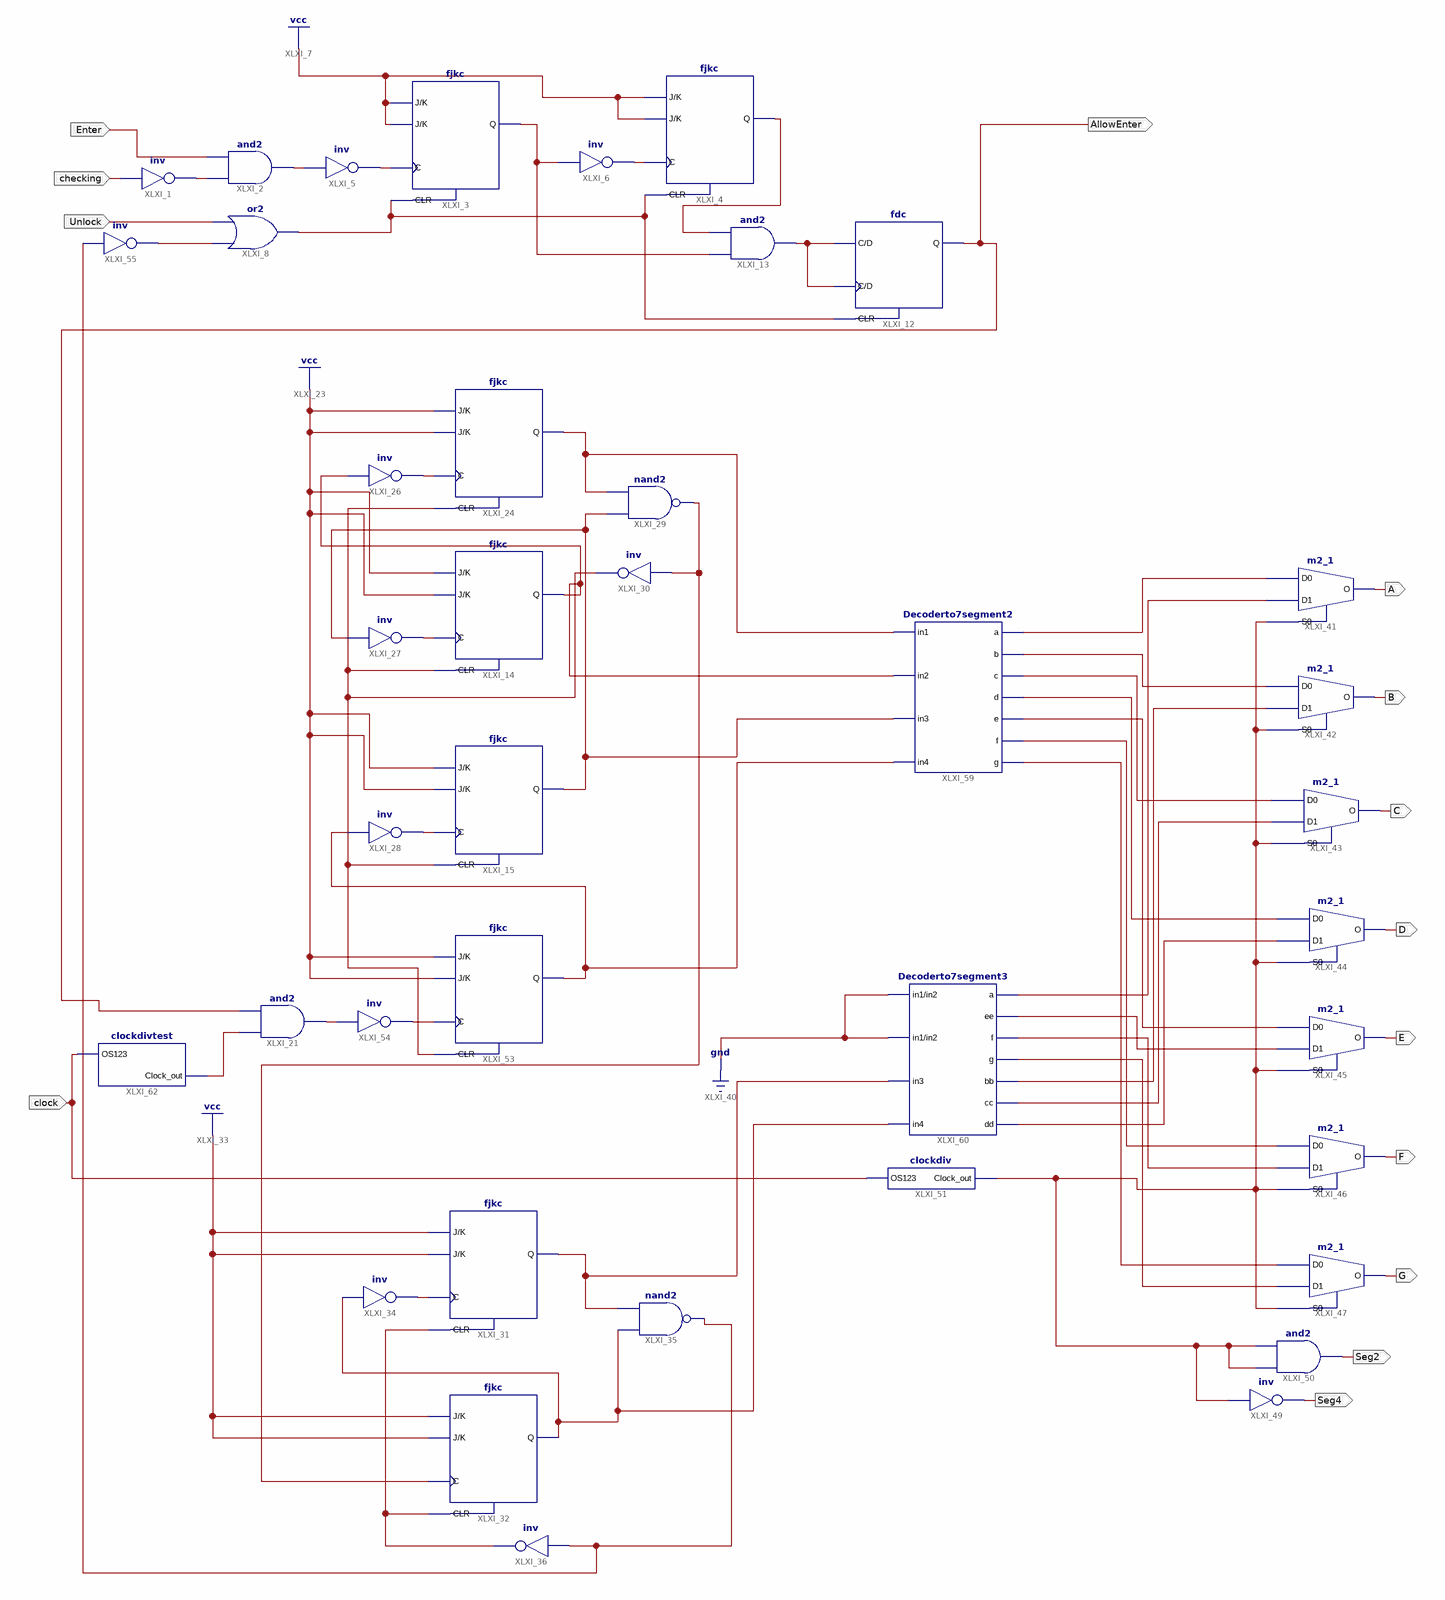
[diagram p0: schematic sheet 1]
// Xilinx ISE schematic counter30.sch (spartan6) as structural Verilog: 39 symbols, 14 ports
module counter30 (
  input  checking,
  input  Enter,
  input  Unlock,
  input  clock,
  output AllowEnter,
  output Seg4,
  output A,
  output B,
  output C,
  output D,
  output E,
  output F,
  output G,
  output Seg2
);

  wire XLXN_33, XLXN_35, XLXN_36, XLXN_38, XLXN_39, XLXN_45, XLXN_49, XLXN_50, XLXN_70, XLXN_71, XLXN_72,
       XLXN_73, XLXN_75, XLXN_76, XLXN_77, XLXN_78, XLXN_83, XLXN_84, XLXN_85, XLXN_86, XLXN_87, XLXN_96,
       XLXN_97, XLXN_98, XLXN_102, XLXN_103, XLXN_104, XLXN_105, XLXN_106, XLXN_107, XLXN_108, XLXN_109,
       XLXN_110, XLXN_111, XLXN_112, XLXN_126, XLXN_132, XLXN_133, XLXN_144, XLXN_145, XLXN_152;

  not XLXI_1 (XLXN_33, checking);
  and XLXI_2 (XLXN_35, XLXN_33, Enter);
  fjkc XLXI_3 (.C(XLXN_36), .CLR(XLXN_50), .J(1'b1), .K(1'b1), .Q(XLXN_39));
  fjkc XLXI_4 (.C(XLXN_38), .CLR(XLXN_50), .J(1'b1), .K(1'b1), .Q(XLXN_45));
  not XLXI_5 (XLXN_36, XLXN_35);
  not XLXI_6 (XLXN_38, XLXN_39);
  or XLXI_8 (XLXN_50, XLXN_145, Unlock);
  fdc XLXI_12 (.C(XLXN_49), .CLR(XLXN_50), .D(XLXN_49), .Q(AllowEnter));
  and XLXI_13 (XLXN_49, XLXN_39, XLXN_45);
  fjkc XLXI_14 (.C(XLXN_71), .CLR(XLXN_132), .J(1'b1), .K(1'b1), .Q(XLXN_75));
  fjkc XLXI_15 (.C(XLXN_72), .CLR(XLXN_132), .J(1'b1), .K(1'b1), .Q(XLXN_76));
  fjkc XLXI_24 (.C(XLXN_70), .CLR(XLXN_132), .J(1'b1), .K(1'b1), .Q(XLXN_77));
  not XLXI_26 (XLXN_70, XLXN_75);
  not XLXI_27 (XLXN_71, XLXN_76);
  not XLXI_28 (XLXN_72, XLXN_73);
  nand XLXI_29 (XLXN_78, XLXN_76, XLXN_77);
  not XLXI_30 (XLXN_132, XLXN_78);
  fjkc XLXI_31 (.C(XLXN_83), .CLR(XLXN_86), .J(1'b1), .K(1'b1), .Q(XLXN_85));
  fjkc XLXI_32 (.C(XLXN_78), .CLR(XLXN_86), .J(1'b1), .K(1'b1), .Q(XLXN_84));
  not XLXI_34 (XLXN_83, XLXN_84);
  nand XLXI_35 (XLXN_87, XLXN_84, XLXN_85);
  not XLXI_36 (XLXN_86, XLXN_87);
  m2_1 XLXI_41 (.D0(XLXN_96), .D1(XLXN_97), .S0(XLXN_144), .O(A));
  m2_1 XLXI_42 (.D0(XLXN_98), .D1(XLXN_102), .S0(XLXN_144), .O(B));
  m2_1 XLXI_43 (.D0(XLXN_103), .D1(XLXN_104), .S0(XLXN_144), .O(C));
  m2_1 XLXI_44 (.D0(XLXN_105), .D1(XLXN_106), .S0(XLXN_144), .O(D));
  m2_1 XLXI_45 (.D0(XLXN_107), .D1(XLXN_108), .S0(XLXN_144), .O(E));
  m2_1 XLXI_46 (.D0(XLXN_110), .D1(XLXN_109), .S0(XLXN_144), .O(F));
  m2_1 XLXI_47 (.D0(XLXN_112), .D1(XLXN_111), .S0(XLXN_144), .O(G));
  not XLXI_49 (Seg4, XLXN_144);
  and XLXI_50 (Seg2, XLXN_144, XLXN_144);
  clockdiv XLXI_51 (.OS123(clock), .Clock_out(XLXN_144));
  fjkc XLXI_53 (.C(XLXN_133), .CLR(XLXN_132), .J(1'b1), .K(1'b1), .Q(XLXN_73));
  not XLXI_54 (XLXN_133, XLXN_126);
  and XLXI_21 (XLXN_126, XLXN_152, AllowEnter);
  not XLXI_55 (XLXN_145, XLXN_87);
  Decoderto7segment2 XLXI_59 (
    .in1(XLXN_77), .in2(XLXN_75), .in3(XLXN_76), .in4(XLXN_73), .a(XLXN_96), .b(XLXN_98), .c(XLXN_103),
    .d(XLXN_105), .e(XLXN_107), .f(XLXN_110), .g(XLXN_112));
  Decoderto7segment3 XLXI_60 (
    .in1(1'b0), .in2(1'b0), .in3(XLXN_85), .in4(XLXN_84), .a(XLXN_97), .ee(XLXN_108), .f(XLXN_109),
    .g(XLXN_111), .bb(XLXN_102), .cc(XLXN_104), .dd(XLXN_106));
  clockdivtest XLXI_62 (.OS123(clock), .Clock_out(XLXN_152));
endmodule
